# EAGLE design untitled (EAGLE 9.6.2)
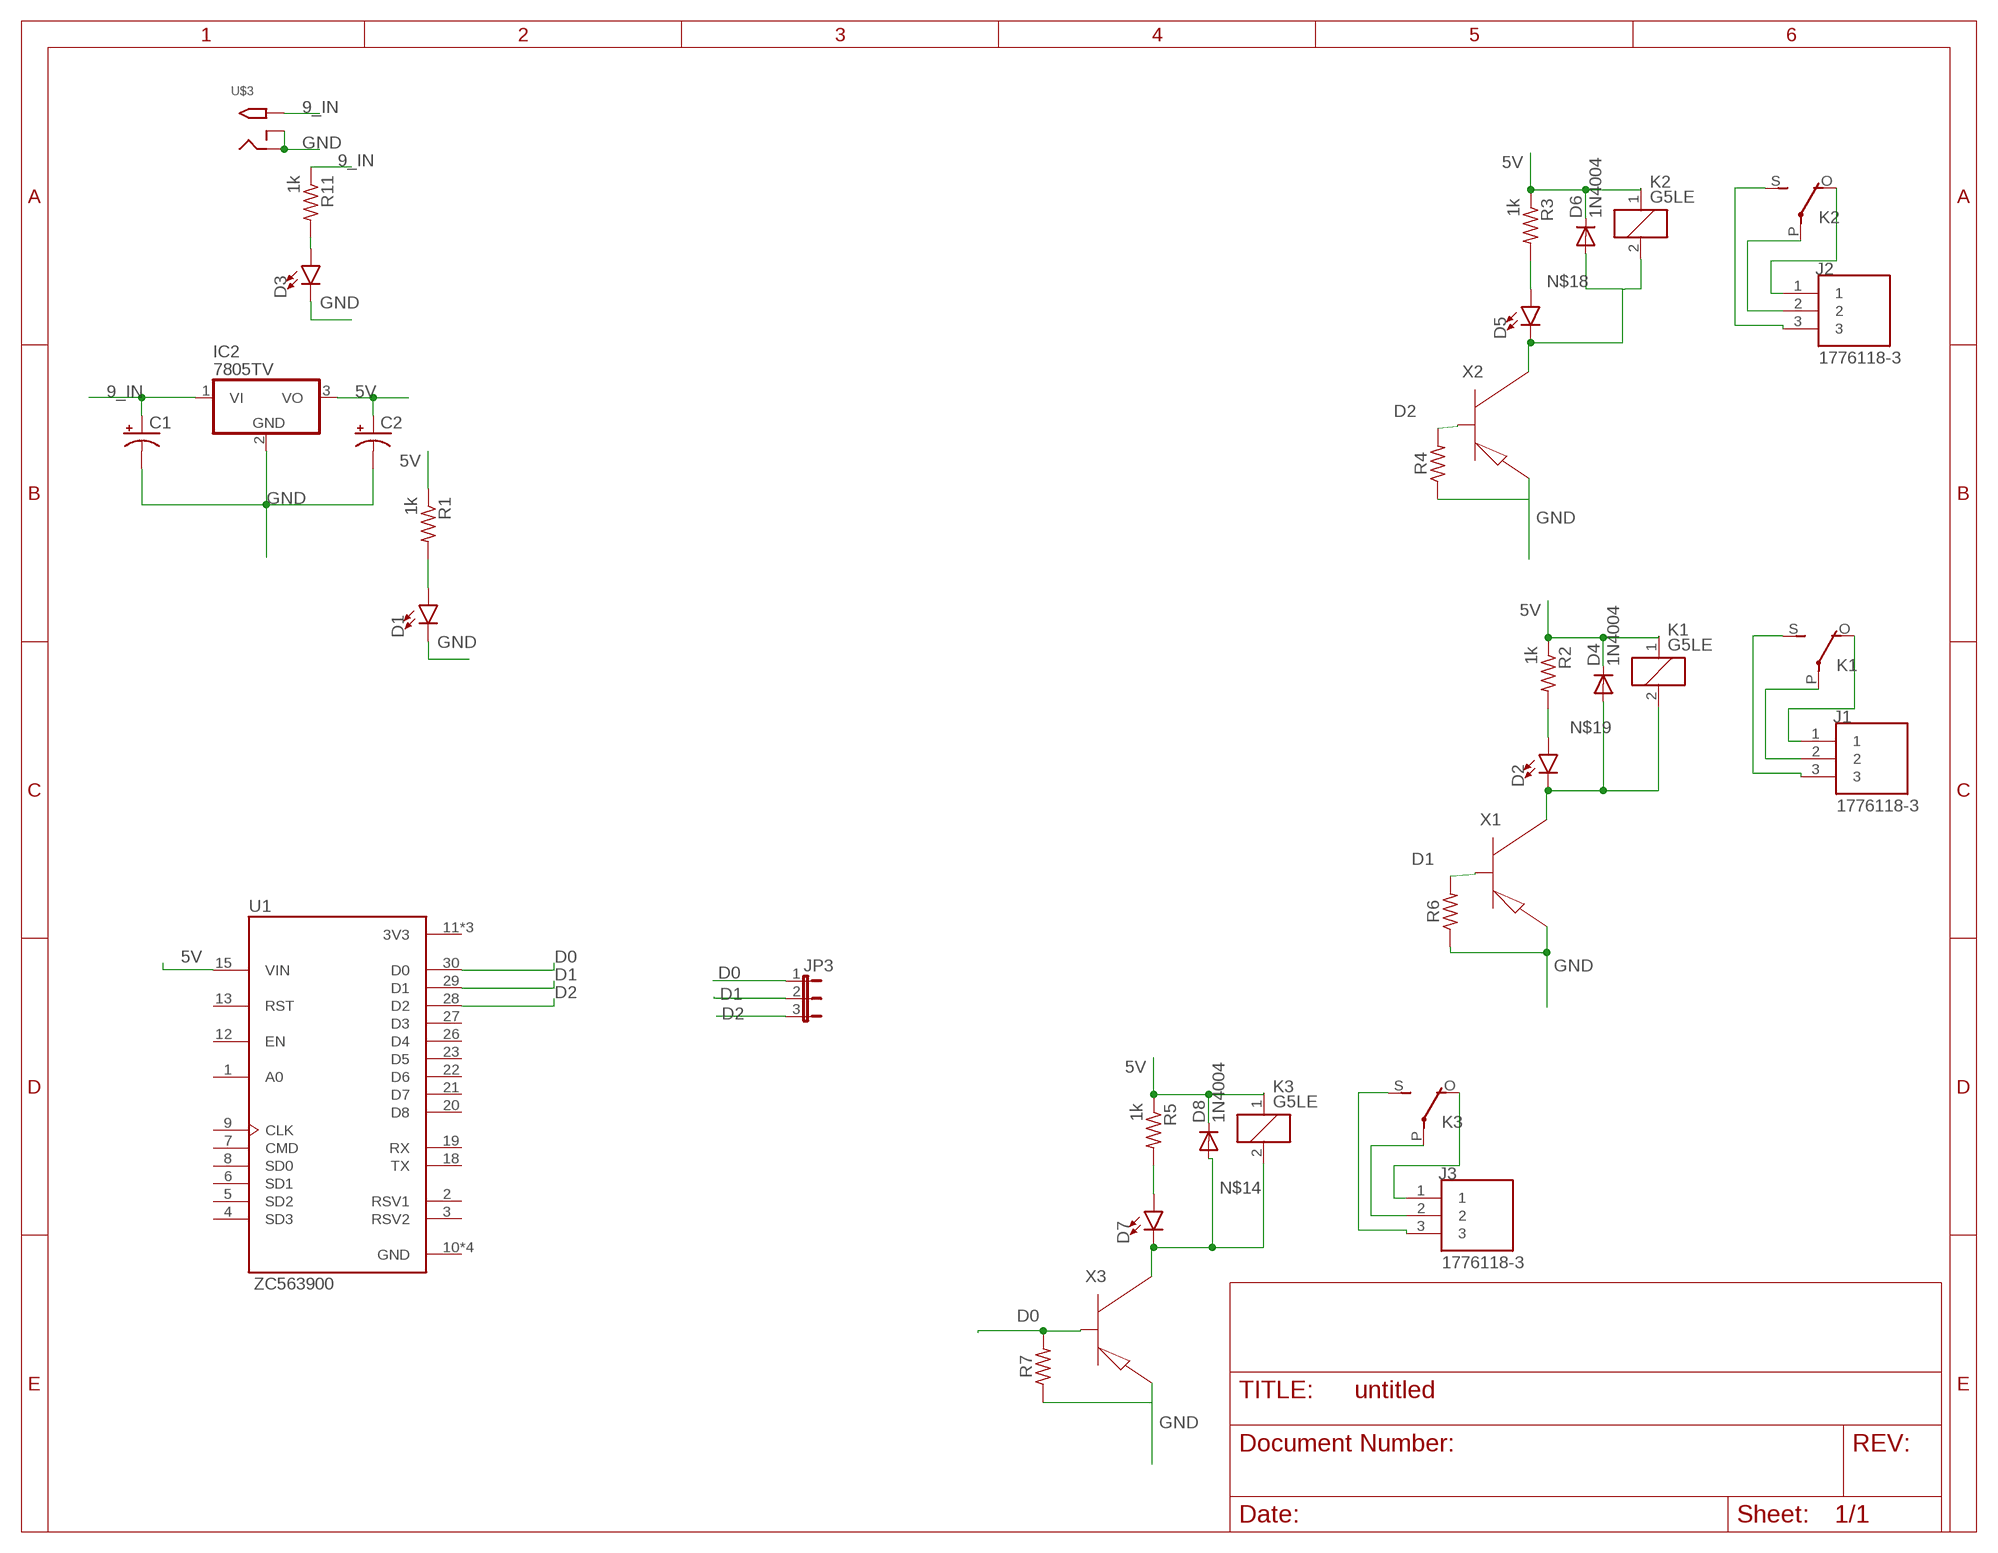
[diagram p0: schematic, sheet 1]

## Parts
C1  CPOL-USE3.5-8  [E3,5-8]
C2  CPOL-USE3.5-8  [E3,5-8]
D1  LED3MM  [LED_3MM]
D2  LED3MM  [LED_3MM]
D3  LED3MM  [LED_3MM]
D4  1N4004  [DO41-10]
D5  LED3MM  [LED_3MM]
D6  1N4004  [DO41-10]
D7  LED3MM  [LED_3MM]
D8  1N4004  [DO41-10]
IC2  7805TV  [TO220V]
J1  1776118-3  [TE_1776118-3]
J2  1776118-3  [TE_1776118-3]
J3  1776118-3  [TE_1776118-3]
JP3  JP2W  [JP2W]
K1  G5LE  [G5LE]
K2  G5LE  [G5LE]
K3  G5LE  [G5LE]
R1  1k  R-US_M0805  [M0805]
R2  1k  R-US_M0805  [M0805]
R3  1k  R-US_M0805  [M0805]
R4  330  R-US_M0805  [M0805]
R5  1k  R-US_M0805  [M0805]
R6  330  R-US_M0805  [M0805]
R7  330  R-US_M0805  [M0805]
R11  1k  R-US_M0805  [M0805]
U1  ZC563900  [MODULE_ZC563900]
U$3  2.1MMJACKTHM  [PJ-102A]
X1  2N3906  [TO92]
X2  2N3906  [TO92]
X3  2N3906  [TO92]

## Nets
5V: C2.+ D4.C D6.C D8.C IC2.3(VO) K1.1 K2.1 K3.1 R1.1 R2.1 R3.1 R5.1 U1.15(VIN)
9_IN: C1.+ IC2.1(VI) R11.1 U$3.TIP
D0: JP3.1 R7.2 U1.30(D0) X3.2(B)
D1: JP3.2 R6.2 U1.29(D1) X1.2(B)
D2: JP3.3 R4.2 U1.28(D2) X2.2(B)
GND: C1.- C2.- D1.K(C) D3.K(C) IC2.2(GND) R4.1 R6.1 R7.1 U$3.RING U$3.RING_SW X1.3(E) X2.3(E) X3.3(E)
N$1: D2.K(C) D4.A K1.2 X1.1(C)
N$2: D3.A R11.2
N$3: D1.A R1.2
N$4: D7.A R5.2
N$5: J1.2 K1.P(2:P)
N$6: J1.1 K1.O(2:O)
N$7: J1.3 K1.S(2:S)
N$9: D5.K(C) D6.A K2.2 X2.1(C)
N$10: J2.2 K2.P(2:P)
N$11: J2.1 K2.O(2:O)
N$12: J2.3 K2.S(2:S)
N$14: D7.K(C) D8.A K3.2 X3.1(C)
N$15: J3.2 K3.P(2:P)
N$16: J3.1 K3.O(2:O)
N$17: J3.3 K3.S(2:S)
N$18: D5.A R3.2
N$19: D2.A R2.2
Unconnected: U1.1(A0) U1.2(RSV1) U1.3(RSV2) U1.4(SD3) U1.5(SD2) U1.6(SD1) U1.7(CMD) U1.8(SD0) U1.9(CLK) U1.12(EN) U1.13(RST) U1.18(TX) U1.19(RX) U1.20(D8) U1.21(D7) U1.22(D6) U1.23(D5) U1.26(D4) U1.27(D3)

## Power pins joined to a net without a drawn wire
3V3: U1.11(3V3) U1.16(3V3) U1.25(3V3)
GND: U1.10(GND) U1.14(GND) U1.17(GND) U1.24(GND)

## Library data of the parts
C1 C2 = adafruit:CPOL-US: POLARIZED CAPACITOR, American symbol
D1-D3 D5 D7 = SparkFun-LED:LED: LED (Generic) Standard schematic elements and footprints for 5mm, 3mm, 1206, and 0603 sized LEDs. Generic LEDs with no color specified.; PROD_ID: DIO-08794
D4 D6 D8 = adafruit:1N4004: DIODE General purpose 1N400x type rectifier (With bigger pads) http://www.ladyada.net/library/pcb/eaglelibrary.html
IC2 = linear:78*: Positive VOLTAGE REGULATOR Source: http://cache.national.com/ds/LM/LM78L05.pdf http://www.fairchildsemi.com/ds/LM/LM7805.pdf
J1-J3 = 1776118-3:1776118-3: Check prices <https://pricing.snapeda.com/parts/1776118-3/TE%20Connectivity/view-part?ref=eda>; AVAILABILITY: In Stock; CENTERLINE_PITCH: 5 mm[.197 in]; COMMENT: 1776118-3; DESCRIPTION: Conn Terminal Block F 3 POS 5mm Solder ST Thru-Hole Package; EU_ROHS_COMPLIANCE: Compliant with Exemptions; MF: TE Connectivity; MP: 1776118-3; NUMBER_OF_POSITIONS: 3; PACKAGE: None; PRICE: None; PURCHASE-URL: https://pricing.snapeda.com/search/part/1776118-3/?ref=eda
JP3 = jumper:JP2W: JUMPER
K1-K3 = relay:G5LE: RELAY 1 x switch, 10 A/120 V AC, 8 A/30 V DC, Omron; OC_FARNELL: unknown; OC_NEWARK: unknown
R1-R7 R11 = adafruit:R-US_: RESISTOR, American symbol
U1 = nodemcuZC563900:ZC563900: NodeMcu Lua ESP8266 WIFI Internet of Things Network Development Module Board; AVAILABILITY: Unavailable; DESCRIPTION: NodeMcu Lua ESP8266 WIFI Internet of Things Network Development Module Board; MF: YKS; MP: ZC563900; PACKAGE: None; PRICE: None
U$3 = adafruit:2.1MMJACK: 2.1mm x 5.5mm THM DC jack with internal switch. Digikey part #PJ-102A, 4UCON part #05537 2.1mm x 5.5mm SMT DC jack with internal switch. Digikey part #PJ-002A-SMT, 4UCON part #03267 By microbuilder.eu & adafruit.com
X1-X3 = sym:2N3906: General Purpose Transistors PNP Silicon Source: Dat aSheet <http://www.onsemi.com/pub_link/Collateral/2N3906-D.PDF>

## Board
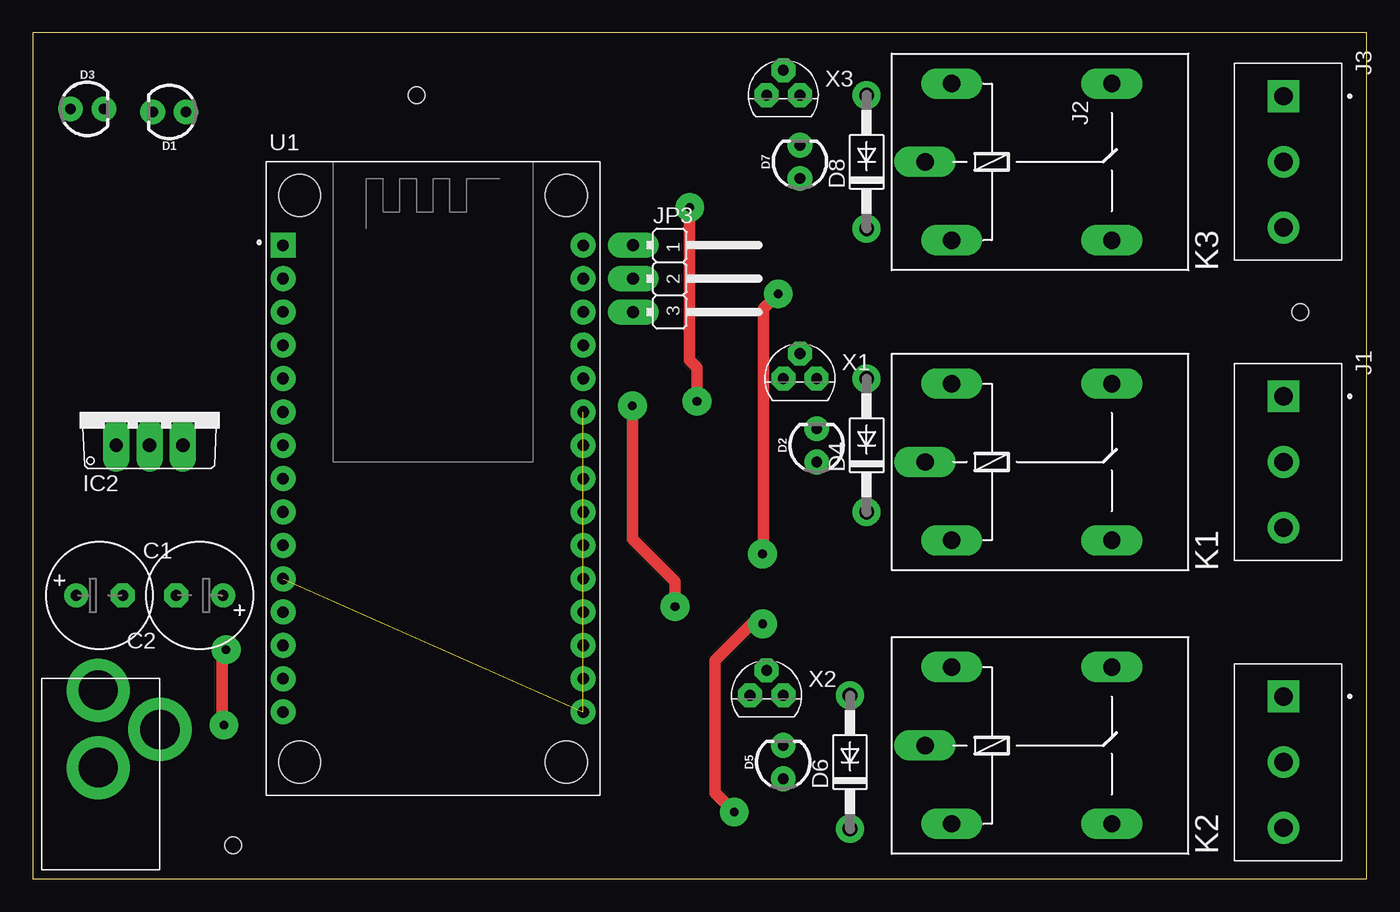
[diagram p1: board, top side]
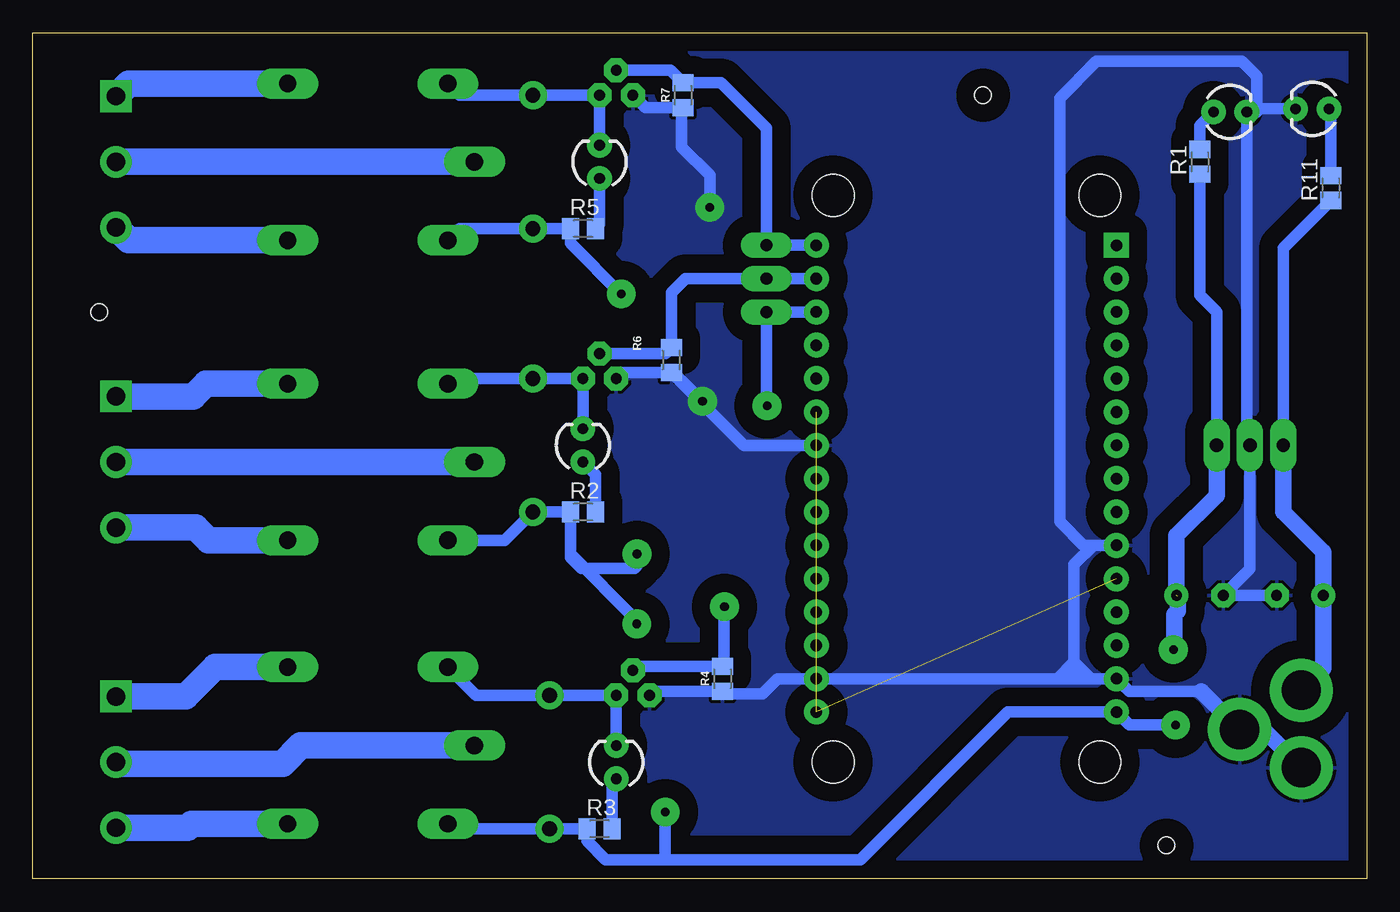
[diagram p2: board, bottom side, seen from below]

Size 101.58 x 64.44 mm. Coordinates in mm from the lower left corner, seen from the top.
Outline: 0,0 101.58,0 101.58,64.44 0,64.44 0,0
Copper layers (1*16): Top 0.035mm / dielectric 1.5mm / Bottom 0.035mm
Design rules "default *": minimum track width 6mil, minimum drill 0.35mm, track to track 6mil, track to pad 6mil, pad to pad 6mil, via to via 6mil, smd to smd 6mil, copper to edge 40mil, drill to drill 6mil, minimum pad ring 20mil, minimum via ring 30mil, stop-mask expansion 4mil, vias tented up to drill 0mil, thermal gap 10mil
Holes 1.27 mm at 15.24,2.54 96.52,43.18 29.21,59.69

### Footprints (pad centres in the part's own frame; a part is rotated, then mirrored left to right if it is on the bottom)
E3,5-8 = drill 0.813 pad 1.6: + -1.778,0 | drill 0.813 pad 1.6 octagon: - 1.778,0
LED_3MM = drill 0.813 pad 1.88: A -1.27,0; K 1.27,0
DO41-10 = drill 1.118 pad 1.93: A 5.08,0; C -5.08,0
TO220V = drill 1.016 long: 1 -2.54,-2.54; 2 0,-2.54; 3 2.54,-2.54
TE_1776118-3 = drill 1.4 square: 1 -5,0 | drill 1.4: 2 0,0; 3 5,0
JP2W = drill 0.914 long: 1 -2.54,-1.27; 2 0,-1.27; 3 2.54,-1.27
G5LE = drill 1.321 long: 1 -7.493,-5.969; 2 -7.493,5.969; O 4.699,5.969; P -9.525,0; S 4.699,-5.969
M0805 = smd 1.3 x 1.6: 1 -0.95,0; 2 0.95,0
MODULE_ZC563900 = drill 0.889 pad 1.753 square: 1 -11.43,17.78 | drill 0.889 pad 1.753: 2 -11.43,15.24; 3 -11.43,12.7; 4 -11.43,10.16; 5 -11.43,7.62; 6 -11.43,5.08; 7 -11.43,2.54; 8 -11.43,0; 9 -11.43,-2.54; 10 -11.43,-5.08; 11 -11.43,-7.62; 12 -11.43,-10.16; 13 -11.43,-12.7; 14 -11.43,-15.24; 15 -11.43,-17.78; 16 11.43,-17.78; 17 11.43,-15.24; 18 11.43,-12.7; 19 11.43,-10.16; 20 11.43,-7.62; 21 11.43,-5.08; 22 11.43,-2.54; 23 11.43,0; 24 11.43,2.54; 25 11.43,5.08; 26 11.43,7.62; 27 11.43,10.16; 28 11.43,12.7; 29 11.43,15.24; 30 11.43,17.78 | hole 3.2: -10.16,21.59; 10.16,21.59; 10.16,-21.59; -10.16,-21.59
PJ-102A = drill 3 pad 4.8: RING 0.1,-3.39; RING_SW -4.6,-6.29; TIP 0.1,-9.29
TO92 = drill 0.813 octagon: 1 1.27,0; 2 0,1.905; 3 -1.27,0

### Placement (x,y rotation side)
C1  5.08,21.59 0 top
C2  12.7,21.59 180 top
D1  10.4,58.41 180 top
D2  59.69,33.02 90 top
D3  4.14,58.65 0 top
D4  63.5,33.02 90 top
D5  57.15,8.89 90 top
D6  62.23,8.89 90 top
D7  58.42,54.61 90 top
D8  63.5,54.61 90 top
IC2  8.89,35.56 0 top
J1  95.25,31.75 270 top
J2  95.25,8.89 270 top
J3  95.25,54.61 270 top
JP3  46.99,45.72 270 top
K1  77.47,31.75 0 top
K2  77.47,10.16 0 top
K3  77.47,54.61 0 top
R1  12.7,54.61 90 bottom
R2  59.69,27.94 0 bottom
R3  58.42,3.81 0 bottom
R4  49.05,15.24 90 bottom
R5  59.69,49.53 0 bottom
R6  52.95,39.51 90 bottom
R7  52.07,59.69 90 bottom
R11  2.73,52.63 90 bottom
U1  30.48,30.48 0 top
U$3  5.08,5.08 180 top
X1  58.42,38.1 0 top
X2  55.88,13.97 0 top
X3  57.15,59.69 0 top

### Tracks (layer width: path | path; a pad name or v marks a point on that pad's centre or on a via)
3V3  (2 unrouted)
5V  (via drill 0.66)  (1 unrouted)
  Top 0.889: v14.72,17.46 14.43,17.17 14.43,11.83 v14.55,11.71 | v55.56,24.75 55.64,24.83 55.64,43.42 v56.77,44.56 | v53.42,5.08 51.94,6.56 51.94,16.62 54.73,19.41 v55.6,19.41
  Bottom 0.889: IC2.3 11.43,43.18 12.7,44.45 R1.1 | 14.66,17.51 v14.72,17.46 | 14.66,20.14 14.38,20.42 | v14.55,11.71 18.06,11.71 U1.15 27.31,12.7 38.55,1.46 53.42,1.46 | 53.42,1.46 57.95,1.46 59.37,2.88 R3.1 D6.C 69.6,3.81 K2.1 | K3.1 69.09,49.53 D8.C R5.1 60.64,48.42 v56.77,44.56 | R2.1 D4.C 65.66,25.78 K1.1 | R2.1 60.64,24.48 59.78,23.62 55.76,23.62 55.56,23.82 v55.56,24.75 | 53.42,1.46 v53.42,5.08 | v55.6,19.41 55.6,19.69 60.64,24.74 R2.1
  Bottom 1.27: IC2.3 11.43,29.21 14.48,26.16 C2.+ | 14.38,21.49 14.38,20.42 | 14.66,20.14 14.66,17.51
9_IN
  Bottom 0.889: R11.1 6.35,48.05 IC2.1
  Bottom 1.27: IC2.1 6.35,27.94 3.3,24.89 C1.+ 3.3,16.05 U$3.TIP
D0
  Bottom 0.889: U1.30 JP3.1 45.72,57.17 49.19,60.64 R7.2 53.02,61.59 X3.2
D1
  Bottom 0.889: U1.29 JP3.2 51.87,45.72 52.95,44.64 R6.2 53.41,40 X1.2
D2  (via drill 0.66)
  Top 0.889: v45.66,36.04 45.66,25.89 48.91,22.64 v48.91,20.73
  Bottom 0.889: X2.2 55.56,16.19 R4.2 48.95,16.3 48.95,20.69 v48.91,20.73 | U1.28 JP3.3 45.72,36.1 v45.66,36.04
GND  (via drill 0.65, 0.66)
  Top 0.889: v50.58,36.36 50.58,38.94 49.99,39.52 49.99,51.12 v50.02,51.15
  Bottom 0.889: D3.K 8.38,58.65 | C1.- C2.- 8.89,23.62 IC2.2 9.13,33.26 D1.K 8.38,58.41 8.38,58.65 | U1.14 18.08,14.27 12.58,14.27 | U1.14 22.29,15.24 | 22.29,15.24 23.57,15.24 | 23.57,15.24 U1.17 44.85,15.24 46.02,14.08 48.84,14.08 R4.1 54.29,14.29 X2.3 | U1.24 47.41,33.02 R6.1 | X3.3 54.93,58.74 R7.1 52.17,58.64 52.17,55.74 50.02,53.59 v50.02,51.15 | R6.1 56.69,38.56 X1.3 | R6.1 52.77,38.56 v50.58,36.36 | 22.29,16.52 22.29,23.93 20.82,25.4 U1.10 21.57,25.4 23.38,27.21 23.38,59.45 20.57,62.26 9.5,62.26 8.38,61.14 8.38,58.65 | 22.29,16.52 21.01,15.24 U1.14 | 22.29,16.52 23.57,15.24 | 22.29,16.52 22.29,15.24
  Bottom 1.27: U$3.RING 7.88,11.37 U$3.RING_SW 12.58,14.27
  pour Bottom (isolate 1.397): 0.31,0.04 0.31,63.54 -0.22,64.06 61.97,64.06 61.97,0.27 62.21,0.04
N$1
  Bottom 0.889: K1.2 69.6,38.1 D4.A X1.1 D2.K
N$2
  Bottom 0.889: D3.A 2.73,58.51 R11.2
N$3
  Bottom 0.889: D1.A 12.7,57.38 R1.2
N$4
  Bottom 0.889: D7.A 58.42,49.85 R5.2
N$5
  Bottom 2.032: K1.P J1.2
N$6
  Bottom 0.889: J1.1
  Bottom 2.032: J1.1 89.37,36.74 88.4,37.72 K1.O
N$7
  Bottom 2.032: K1.S 88.19,25.78 89.16,26.75 J1.3
N$9
  Bottom 0.889: D5.K X2.1 D6.A 67.82,13.97 K2.2
N$10
  Bottom 0.889: 95.13,8.77 J2.2
  Bottom 2.032: K2.P 81.18,10.16 82.56,8.77 95.13,8.77
N$11
  Bottom 2.032: K2.O 87.68,16.13 89.92,13.89 J2.1
N$12
  Bottom 0.889: 89.47,4.19 89.77,3.89
  Bottom 2.032: K2.S 89.47,4.19 | 89.77,3.89 J2.3
N$14
  Bottom 0.889: D7.K X3.1 D8.A 69.09,59.69 K3.2
N$15
  Bottom 2.032: K3.P J3.2
N$16
  Bottom 2.032: K3.O 94.28,60.58 J3.1
N$17
  Bottom 2.032: K3.S 94.28,48.64 J3.3
N$18
  Bottom 0.889: D5.A 57.47,7.3 R3.2
N$19
  Bottom 0.889: D2.A 58.74,30.8 R2.2